# Altium schematic sheet CellConnections.SchDoc: Cell Connections
size A3; DrawnBy: Sam Haines; DocumentNumber: 7; Revision: 01; SheetNumber: 7; SheetTotal: 10; Version: 01; Project: Battery Managment System 2020; PageSetup: Record=PageOptions|CenterHorizontal=True|CenterVertical=True|PrintScale=0.97|XCorrection=1.00|YCorrection=1.00|PrintKind=0|BorderSize=5000000|LeftOffset=0|BottomOffset=0|Orientation=2|PaperLength=1000|PaperWidth=1000|Scale=100|PaperSource=7|PrintQuality=-4|MediaType=1|DitherType=10|PaperKind=A4|PrintScaleMode=1
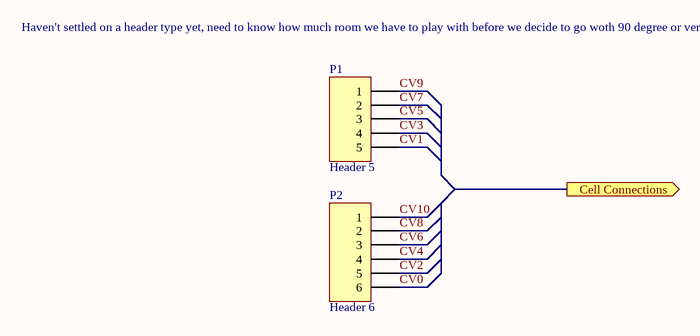
[diagram p0: CellConnections.SchDoc]

## Parts
P1  Header 5  [HDR1X5]
P2  Header 6  [HDR1X6]

## Ports
Cell Connections (out)

## Nets
CV0: P2.6
CV1: P1.5
CV2: P2.5
CV3: P1.4
CV4: P2.4
CV5: P1.3
CV6: P2.3
CV7: P1.2
CV8: P2.2
CV9: P1.1
CV10: P2.1

## Notes on the sheet
- Haven't settled on a header type yet, need to know how much room we have to play with before we decide to go woth 90 degree or vertical microfits
- Revision History:
- Sheet Title:
- Rev
- Date
- Description
- Project:
- Size:
- Drawn By:
- A3
- Number:
- Revision:
- Sheet
- Version:
- of
- QUT Motorsport
- O-120, Gardens Point
- 2 George Street
- Brisbane, QLD 4000
- Australia
- Print Date:
- Print Time:
- File Name:

## Library data of the parts
P1 = Header 5: Header, 5-Pin; LatestRevisionDate: 17-Jul-2002; LatestRevisionNote: Re-released for DXP Platform.; Publisher: Altium Limited
P2 = Header 6: Header, 6-Pin; LatestRevisionDate: 17-Jul-2002; LatestRevisionNote: Re-released for DXP Platform.; Publisher: Altium Limited